# EAGLE design board (EAGLE 7.3.0)
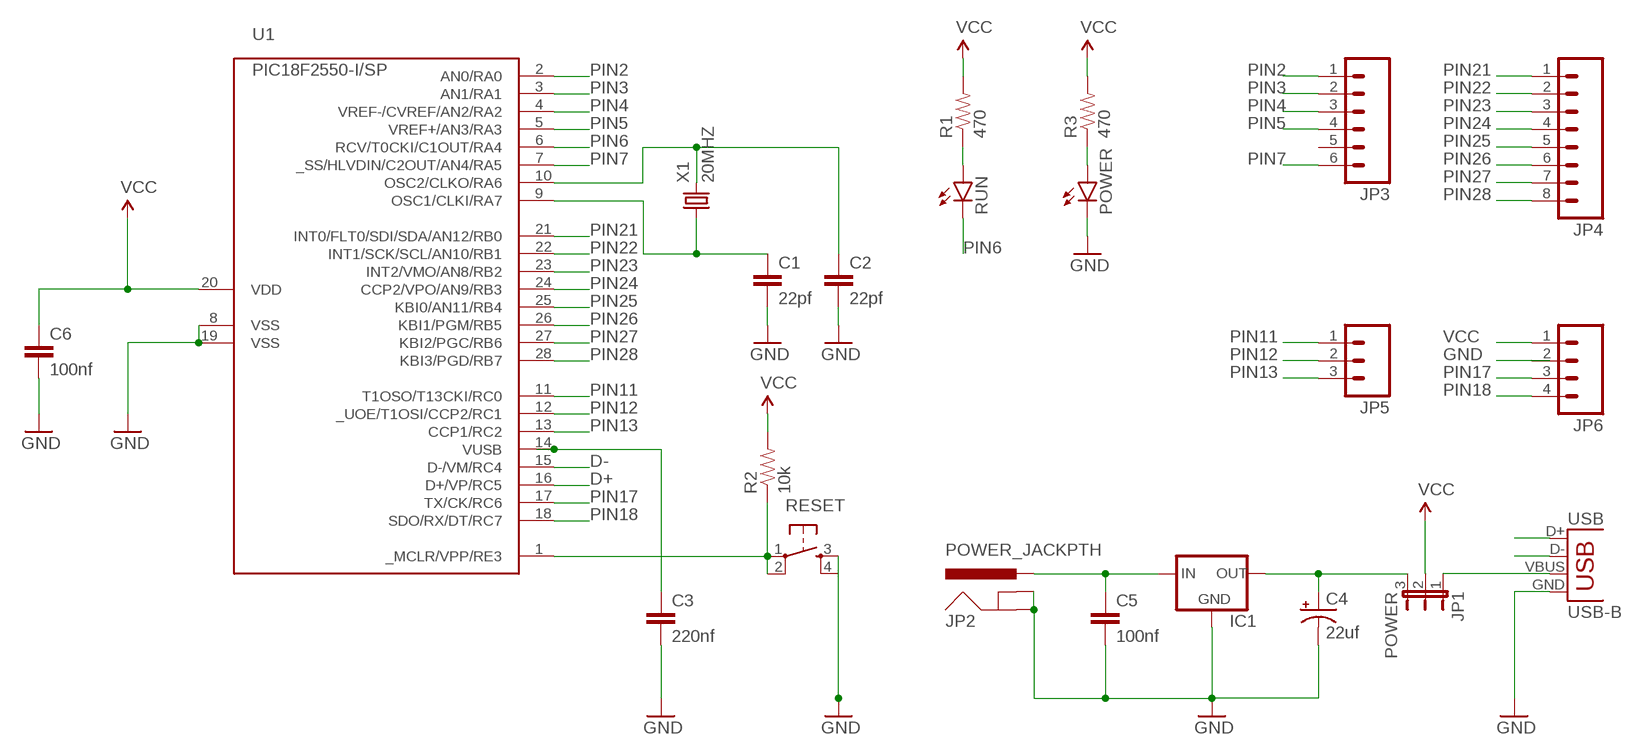
[diagram p0: schematic, sheet 1]

## Parts
C1  22pf  0.1UF-50V-20%(PTH)KIT-EZ  [CAP-PTH-SMALL-KIT]
C2  22pf  0.1UF-50V-20%(PTH)KIT-EZ  [CAP-PTH-SMALL-KIT]
C3  220nf  C-EU050-050X075  [C050-050X075]
C4  22uf  10UF-25V-20%(PTH)KIT  [CPOL-RADIAL-10UF-25V-KIT]
C5  100nf  C-EU050-050X075  [C050-050X075]
C6  100nf  C-EU050-050X075  [C050-050X075]
IC1  78XXL  [78XXL]
JP1  POWER  JP2E  [JP2]
JP2  POWER_JACKPTH  [POWER_JACK_PTH]
JP3  M06NO_SILK_YES_STOP  [1X06_NO_SILK_YES_STOP]
JP4  M08NO_SILK_FEMALE_PTH  [1X08_NO_SILK]
JP5  M031X03_NO_SILK  [1X03_NO_SILK]
JP6  M04NO_SILK_ALL_ROUND  [1X04_NO_SILK_ALL_ROUND]
POWER  LED3MM  [LED3MM]
R1  470  RESISTORPTH-1/4W  [AXIAL-0.4]
R2  10k  RESISTORPTH-1/4W  [AXIAL-0.4]
R3  470  RESISTORPTH-1/4W  [AXIAL-0.4]
RESET  TAC_SWITCHPTH  [TACTILE-PTH]
RUN  LED3MM  [LED3MM]
U1  PIC18F2550-I/SP  [DIL28-3]
USB  USB-B  USBPTH  [USB-B-PTH]
X1  20MHZ  CRYSTALS-NOGND-HC49  [HC49]

## Nets
D+: U1.16(D+/VP/RC5) USB.D+
D-: U1.15(D-/VM/RC4) USB.D-
GND: C1.2 C2.2 C3.2 C4.2(-) C5.2 C6.2 IC1.GND JP2.GND JP2.GNDBREAK POWER.K(C) RESET.3 RESET.4 U1.8(VSS) U1.19(VSS) USB.GND
N$1: C2.1 U1.10(OSC2/CLKO/RA6) X1.2
N$2: C1.1 U1.9(OSC1/CLKI/RA7) X1.1
N$3: R1.P$1 RUN.A
N$4: R2.P$1 RESET.1 RESET.2 U1.1(_MCLR/VPP/RE3)
N$6: POWER.A R3.P$1
N$7: C4.1(+) IC1.OUT JP1.3
N$8: JP1.1 USB.VBUS
N$10: C5.1 IC1.IN JP2.PWR
PIN2: JP3.1 U1.2(AN0/RA0)
PIN3: JP3.2 U1.3(AN1/RA1)
PIN4: JP3.3 U1.4(VREF-/CVREF/AN2/RA2)
PIN5: JP3.4 U1.5(VREF+/AN3/RA3)
PIN6: RUN.K(C) U1.6(RCV/T0CKI/C1OUT/RA4)
PIN7: JP3.6 U1.7(_SS/HLVDIN/C2OUT/AN4/RA5)
PIN11: JP5.1 U1.11(T1OSO/T13CKI/RC0)
PIN12: JP5.2 U1.12(_UOE/T1OSI/CCP2/RC1)
PIN13: JP5.3 U1.13(CCP1/RC2)
PIN14: C3.1 U1.14(VUSB)
PIN17: JP6.3 U1.17(TX/CK/RC6)
PIN18: JP6.4 U1.18(SDO/RX/DT/RC7)
PIN21: JP4.1 U1.21(INT0/FLT0/SDI/SDA/AN12/RB0)
PIN22: JP4.2 U1.22(INT1/SCK/SCL/AN10/RB1)
PIN23: JP4.3 U1.23(INT2/VMO/AN8/RB2)
PIN24: JP4.4 U1.24(CCP2/VPO/AN9/RB3)
PIN25: JP4.5 U1.25(KBI0/AN11/RB4)
PIN26: JP4.6 U1.26(KBI1/PGM/RB5)
PIN27: JP4.7 U1.27(KBI2/PGC/RB6)
PIN28: JP4.8 U1.28(KBI3/PGD/RB7)
VCC: C6.1 JP1.2 JP6.1 R1.P$2 R2.P$2 R3.P$2 U1.20(VDD)
Unconnected: JP3.5 JP6.2

## Library data of the parts
C1 C2 = SparkFun-Capacitors:0.1UF-50V-20%(PTH): CAP-08370; PROD_ID: CAP-08370
C3 C5 C6 = rcl:C-EU: CAPACITOR, European symbol
C4 = SparkFun-Capacitors:10UF-25V-20%(PTH): CAP-08440; PROD_ID: CAP-08440
IC1 = v-reg:78XXL: VOLTAGE REGULATOR
JP1 = jumper:JP2E: JUMPER
JP2 = SparkFun-Connectors:POWER_JACK: Power Jack This is the standard 5.5mm barrel jack for power. The PTH is the most common, proven, reliable, footprint. The Slot footprint only works if the mill layer is transmitted to the PCB fab house so be warned. Mating wall wart : TOL-00298 (and others); PROD_ID: CONN-08197
JP3 = SparkFun-Connectors:M06: Header 6 Standard 6-pin 0.1" header. Use with straight break away headers (SKU : PRT-00116), right angle break away headers (PRT-00553), swiss pins (PRT-00743), machine pins (PRT-00117), and female headers (PRT-00115). Molex polarized connector foot print use with SKU : PRT-08094 with associated crimp pins and housings. NOTES ON THE VARIANTS LOCK and LOCK_LONGPADS... This footprint was designed to help hold the alignment of a through-hole component (i.e. 6-pin header) while soldering it into place. You may notice that each hole has been shifted either up or down by 0.005 of an inch from it's more standard position (which is a perfectly straight line). This slight alteration caused the pins (the squares in the middle) to touch the edges of the holes. Because they are alternating, it causes a "brace" to hold the component in place. 0.005 has proven to be the perfect amount of "off-center" position when using our standard breakaway headers. Although looks a little odd when you look at the bare footprint, once you have a header in there, the alteration is very hard to notice. Also,if you push a header all the way into place, it is covered up entirely on the bottom side. This idea of altering the position of holes to aid alignment will be further integrated into the Sparkfun Library for other footprints. It can help hold any component with 3 or more connection pins.
JP4 = SparkFun-Connectors:M08: Header 8 Standard 8-pin 0.1" header. Use with straight break away headers (SKU : PRT-00116), right angle break away headers (PRT-00553), swiss pins (PRT-00743), machine pins (PRT-00117), and female headers (PRT-00115).; PROD_ID: CONN-08438
JP5 = SparkFun-Connectors:M03: Header 3 Standard 3-pin 0.1" header. Use with straight break away headers (SKU : PRT-00116), right angle break away headers (PRT-00553), swiss pins (PRT-00743), machine pins (PRT-00117), and female headers (PRT-00115). Molex polarized connector foot print use with SKU : PRT-08232 with associated crimp pins and housings.
JP6 = SparkFun-Connectors:M04: Header 4 Standard 4-pin 0.1" header. Use with straight break away headers (SKU : PRT-00116), right angle break away headers (PRT-00553), swiss pins (PRT-00743), machine pins (PRT-00117), and female headers (PRT-00115). Molex polarized connector foot print use with SKU : PRT-08231 with associated crimp pins and housings. 1MM SMD Version SKU: PRT-10208
POWER RUN = SparkFun-LED:LED: LEDs Standard schematic elements and footprints for 5mm, 3mm, 1206, and 0603 sized LEDs. 5mm - Spark Fun Electronics SKU : COM-00529 (and others)
R1-R3 = SparkFun-Resistors:RESISTOR: Resistor Basic schematic elements and footprints for 0603, 1206, and PTH resistors.
RESET = SparkFun-Retired:TAC_SWITCH: Momentary Switch Button commonly used for reset or general input. Spark Fun Electronics SKU : COM-00097 SMT- SWCH-08247
U1 = microchip-pic18fxx5x:PIC18*2550: PIC18*2550 Microchip FLASH Microcontroller with FS-USB DEVICE FEATURES Feature PIC18*2550 Program Memory (bytes) 32k Program Memory (instructions) 16384 I/O Ports Ports A, B, C, (E) Capture/Compare/PWM Modules 2 Enhanced Capture/Compare/PWM Modules 0 Parallel Communications (PSP) No 10-bit Analog-to-Digital Module 10 input Channels Package Types 28-pin PDIP 28-pin SOIC NOTES: F only after 18, means standard voltage range from 4.2v to 5.5v LF after 18, means extended voltage range from 2.0v to 5.5v T after entire device number, means supplied in tape and reel TQFP packages only -E before / denotes extended temperature range from -40°C to +120°C -I before / denotes industrial temperature range from -40°C to +85°C /PT suffix denotes TQFP package /SO suffix denotes SOIC package /SP suffix denotes Skinny Plastic DIP package /P suffix denotes Plastic DIP package /ML suffix denotes QFN package
USB = SparkFun-Connectors:USB: USB Connectors USB-B-PTH is fully proven SKU : PRT-00139/CONN-08278 USB-miniB is fully proven SKU : PRT-00587 USB-A-PCB is untested. USB-A-H is throughly reviewed, but untested. Spark Fun Electronics SKU : PRT-00437 USB-B-SMT is throughly reviewed, but untested. Needs silkscreen touching up. USB-A-S has not been used/tested USB-MB-H has not been used/tested USB-MICROB has been used. CONN-09505; PROD_ID: CONN-08278
X1 = IQD-Frequency-Products:CRYSTALS-NOGND: CRYSTALS CAN NOT GROUNDED

## Board
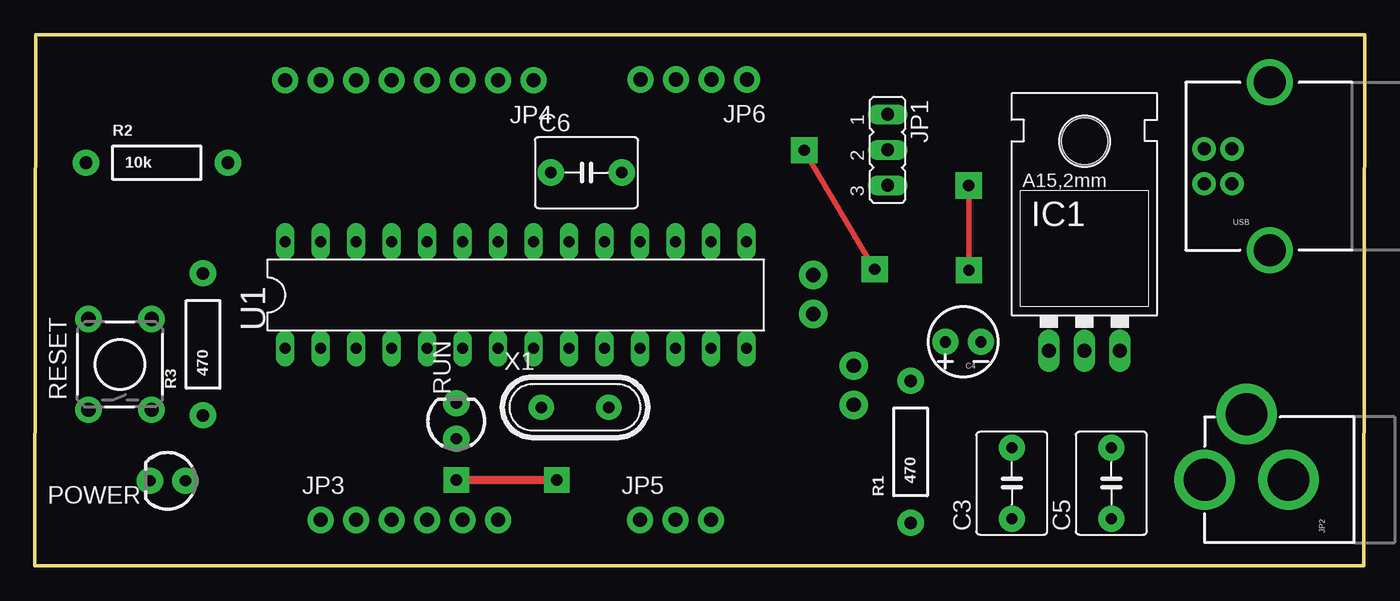
[diagram p1: board, top side]
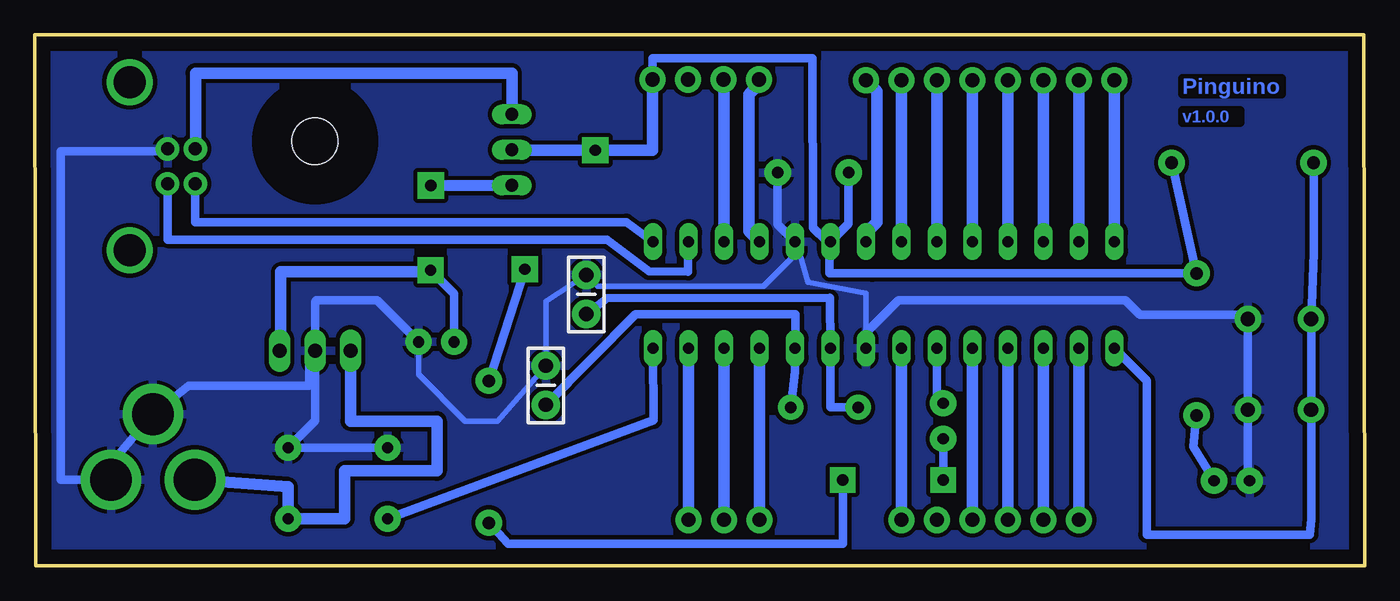
[diagram p2: board, bottom side, seen from below]

Size 95.17 x 37.97 mm. Coordinates in mm from the lower left corner, seen from the top.
Outline: 0,0 95.12,0 95.17,37.97 0.05,37.97 0,0
Copper layers (1*16): Top 0.035mm / dielectric 1.5mm / Bottom 0.035mm
Design rules "default *": minimum track width 10mil, minimum drill 28mil, track to track 8mil, track to pad 8mil, pad to pad 8mil, via to via 8mil, smd to smd 8mil, copper to edge 40mil, drill to drill 8mil, minimum pad ring 10mil, minimum via ring 8mil, stop-mask expansion 4mil, vias tented up to drill 0mil, thermal gap 10mil

### Footprints (pad centres in the part's own frame; a part is rotated, then mirrored left to right if it is on the bottom)
CAP-PTH-SMALL-KIT = drill 1.016 pad 2.032: 1 -1.397,0; 2 1.397,0
C050-050X075 = drill 0.813 pad 1.88: 1 -2.54,0; 2 2.54,0
CPOL-RADIAL-10UF-25V-KIT = drill 0.813 pad 1.88: 1 1.27,0; 2 -1.27,0
78XXL = drill 1.016 long: GND 0,-3.81; IN -2.54,-3.81; OUT 2.54,-3.81 | hole 3.302: 0,11.176
JP2 = drill 0.914 long: 1 -2.54,0; 2 0,0; 3 2.54,0
POWER_JACK_PTH = drill 2.997 pad 4.318: GND 0,7.7; GNDBREAK 4.7,10.7; PWR 0,13.7
1X06_NO_SILK_YES_STOP = drill 1.016 pad 1.88: 1 0,0; 2 2.54,0; 3 5.08,0; 4 7.62,0; 5 10.16,0; 6 12.7,0
1X08_NO_SILK = drill 1.016 pad 1.88: 1 0,0; 2 2.54,0; 3 5.08,0; 4 7.62,0; 5 10.16,0; 6 12.7,0; 7 15.24,0; 8 17.78,0
1X03_NO_SILK = drill 1.016 pad 1.88: 1 0,0; 2 2.54,0; 3 5.08,0
1X04_NO_SILK_ALL_ROUND = drill 1.016 pad 1.88: 1 0,0; 2 2.54,0; 3 5.08,0; 4 7.62,0
LED3MM = drill 0.813 pad 1.88: A -1.27,0; K 1.27,0
AXIAL-0.4 = drill 0.9 pad 1.88: P$1 -5.08,0; P$2 5.08,0
TACTILE-PTH = drill 1.016 pad 1.88: 1 -3.251,2.261; 2 3.251,2.261; 3 -3.251,-2.261; 4 3.251,-2.261
DIL28-3 = drill 0.813 long: 1 -16.51,-3.81; 2 -13.97,-3.81; 3 -11.43,-3.81; 4 -8.89,-3.81; 5 -6.35,-3.81; 6 -3.81,-3.81; 7 -1.27,-3.81; 8 1.27,-3.81; 9 3.81,-3.81; 10 6.35,-3.81; 11 8.89,-3.81; 12 11.43,-3.81; 13 13.97,-3.81; 14 16.51,-3.81; 15 16.51,3.81; 16 13.97,3.81; 17 11.43,3.81; 18 8.89,3.81; 19 6.35,3.81; 20 3.81,3.81; 21 1.27,3.81; 22 -1.27,3.81; 23 -3.81,3.81; 24 -6.35,3.81; 25 -8.89,3.81; 26 -11.43,3.81; 27 -13.97,3.81; 28 -16.51,3.81
USB-B-PTH = drill 0.914 pad 1.676: D+ 0,1.25; D- 1.981,1.25; GND 0,-1.25; VBUS 1.981,-1.25 | drill 2.286: S1 -2.718,-6.02; S2 -2.718,6.02
HC49 = drill 0.813 pad 1.8: 1 -2.413,0; 2 2.413,0

### Placement (x,y rotation side)
C1  55.7,19.4 90 bottom
C2  58.6,12.9 90 bottom
C3  69.92,5.9 90 top
C4  66.43,16.02 180 top
C5  77.04,5.9 90 top
C6  39.47,28.13 0 top
IC1  75.11,19.19 0 top
JP1  61.03,29.76 270 top
JP2  97.42,6.14 90 top
JP3  20.44,3.28 0 top
JP4  35.68,34.73 180 top
JP5  43.3,3.28 0 top
JP6  50.96,34.79 180 top
POWER  9.5,6.07 180 top
R1  62.67,8.15 90 top
R2  8.73,28.83 0 top
R3  12.03,15.84 90 top
RESET  6.09,14.4 90 top
RUN  30.15,10.35 90 top
U1  34.41,19.37 0 top
USB  85.67,28.58 180 top
X1  38.66,11.33 0 top

### Tracks (layer width: path | path; a pad name or v marks a point on that pad's centre or on a via)
D+
  Bottom 0.61: U1.16 48.41,21.02 51.22,21.06 54.2,23.32 85.67,23.32 USB.D+
D-
  Bottom 0.61: USB.D- 83.69,24.57 52.83,24.57 U1.15
GND
  Bottom 0.406: C4.2 67.7,13.69 64.36,10.35 62.04,10.35 C2.2 58.6,18.92 C1.2 54.9,20 43.03,20 40.76,22.26 40.76,22.54 | 40.76,22.54 U1.19 | 35.68,16.67 35.68,19.49 39.83,20.28 40.49,22.54 40.76,22.54
  Bottom 0.61: U1.8 35.68,16.67 33.37,18.98 17.12,18.98 16.1,17.97 8.66,17.97 RESET.4 RESET.3 8.35,6.19 POWER.K | IC1.GND 75.54,14.96 75.54,12.89 84.17,12.89 JP2.GNDBREAK 89.72,7.34 JP2.GND 93.32,6.14 93.32,29.65 85.84,29.65 USB.GND 85.84,30.16 | IC1.GND 75.11,10.37 C5.2 C3.2 | IC1.GND 75.11,18.9 75.03,18.98 70.67,18.98 C4.2 | U1.19 42.01,24.42 C6.2
  pour Bottom (isolate 0.305): -0.92,38.29 -0.92,-1.08 96.87,-1.08 96.87,38.29
N$1
  Bottom 0.61: X1.2 40.76,13.87 U1.10 40.75,18 52.17,18 C2.1
N$2
  Bottom 0.61: X1.1 38.22,11.33 U1.9 38.25,19.17 54.23,19.14 C1.1
N$3  (via drill 0.81 pad 1.83)
  Top 0.61: v30.15,6.12 v37.34,6.13
  Bottom 0.61: 62.67,2.73 R1.P$1 61.31,1.55 37.35,1.55 37.35,5.25 v37.34,6.13 | RUN.A v30.15,6.12
N$4
  Bottom 0.61: R2.P$1 3.65,22.41 RESET.2 RESET.1 3.83,3.32 3.91,2.22 15.59,2.22 15.59,13.25 U1.1
N$6
  Bottom 0.61: POWER.A 12.25,8.5 R3.P$1
N$7  (via drill 0.81 pad 1.88)
  Top 0.406: v66.85,21.14 v66.84,27.19
  Bottom 0.61: 66.85,21.02 v66.85,21.14 65.16,19.45 C4.1 | 77.57,15.38 IC1.OUT
  Bottom 0.813: v66.84,27.19 JP1.3 | 66.85,21.02 77.57,21.02 77.57,15.38
N$8
  Bottom 0.813: JP1.1 61.03,35.24 83.67,35.24 83.67,29.83 USB.VBUS
N$10
  Bottom 0.813: IC1.IN 72.57,10.35 66.39,10.35 66.39,6.79 73,6.79 73,3.36 C5.1 77.04,5.64 JP2.PWR
PIN2
  Bottom 0.813: U1.2 JP3.1
PIN3
  Bottom 0.813: U1.3 JP3.2
PIN4
  Bottom 0.813: U1.4 JP3.3
PIN5
  Bottom 0.813: U1.5 JP3.4
PIN6
  Bottom 0.61: U1.6 30.6,11.87 RUN.K
PIN7
  Bottom 0.813: U1.7 JP3.6
PIN11
  Bottom 0.813: JP5.1 U1.11
PIN12
  Bottom 0.813: JP5.2 U1.12
PIN13
  Bottom 0.813: JP5.3 U1.13
PIN14
  Bottom 0.61: U1.14 50.88,10.39 C3.1
PIN17
  Bottom 0.406: 45.84,34.75 JP6.3
  Bottom 0.813: U1.17 45.84,34.75
PIN18
  Bottom 0.406: 43.34,23.22 U1.18
  Bottom 0.813: 43.34,23.22 44.04,23.92 44.04,33.72 43.34,34.41 JP6.4
PIN21
  Bottom 0.813: JP4.1 34.9,33.94 34.9,24.57 35.68,23.79 U1.21
PIN22
  Bottom 0.813: JP4.2 U1.22
PIN23
  Bottom 0.813: JP4.3 U1.23
PIN24
  Bottom 0.813: JP4.4 U1.24
PIN25
  Bottom 0.813: JP4.5 U1.25
PIN26
  Bottom 0.813: JP4.6 U1.26
PIN27
  Bottom 0.813: JP4.7 U1.27
PIN28
  Bottom 0.813: U1.28 JP4.8
VCC  (via drill 0.81 pad 1.88)
  Top 0.406: v60.1,21.21 v55.05,29.72
  Bottom 0.61: R1.P$2 v60.1,21.21 | R2.P$2 R3.P$2 35.24,20.92 38.29,20.92 38.29,23.12 38.28,23.12 U1.20 36.93,24.47 C6.1 | 38.45,23.18 39.47,24.19 39.52,36.32 50.96,36.32 JP6.1 | v55.05,29.72 54.55,29.72
  Bottom 0.813: JP1.2 61.03,29.72 v55.05,29.72 | v55.05,29.72 55.05,29.73 | U1.20 38.45,23.18 | JP6.1 50.98,29.72 v55.05,29.72

### Text on the board
Bottom: Pinguino | v1.0.0